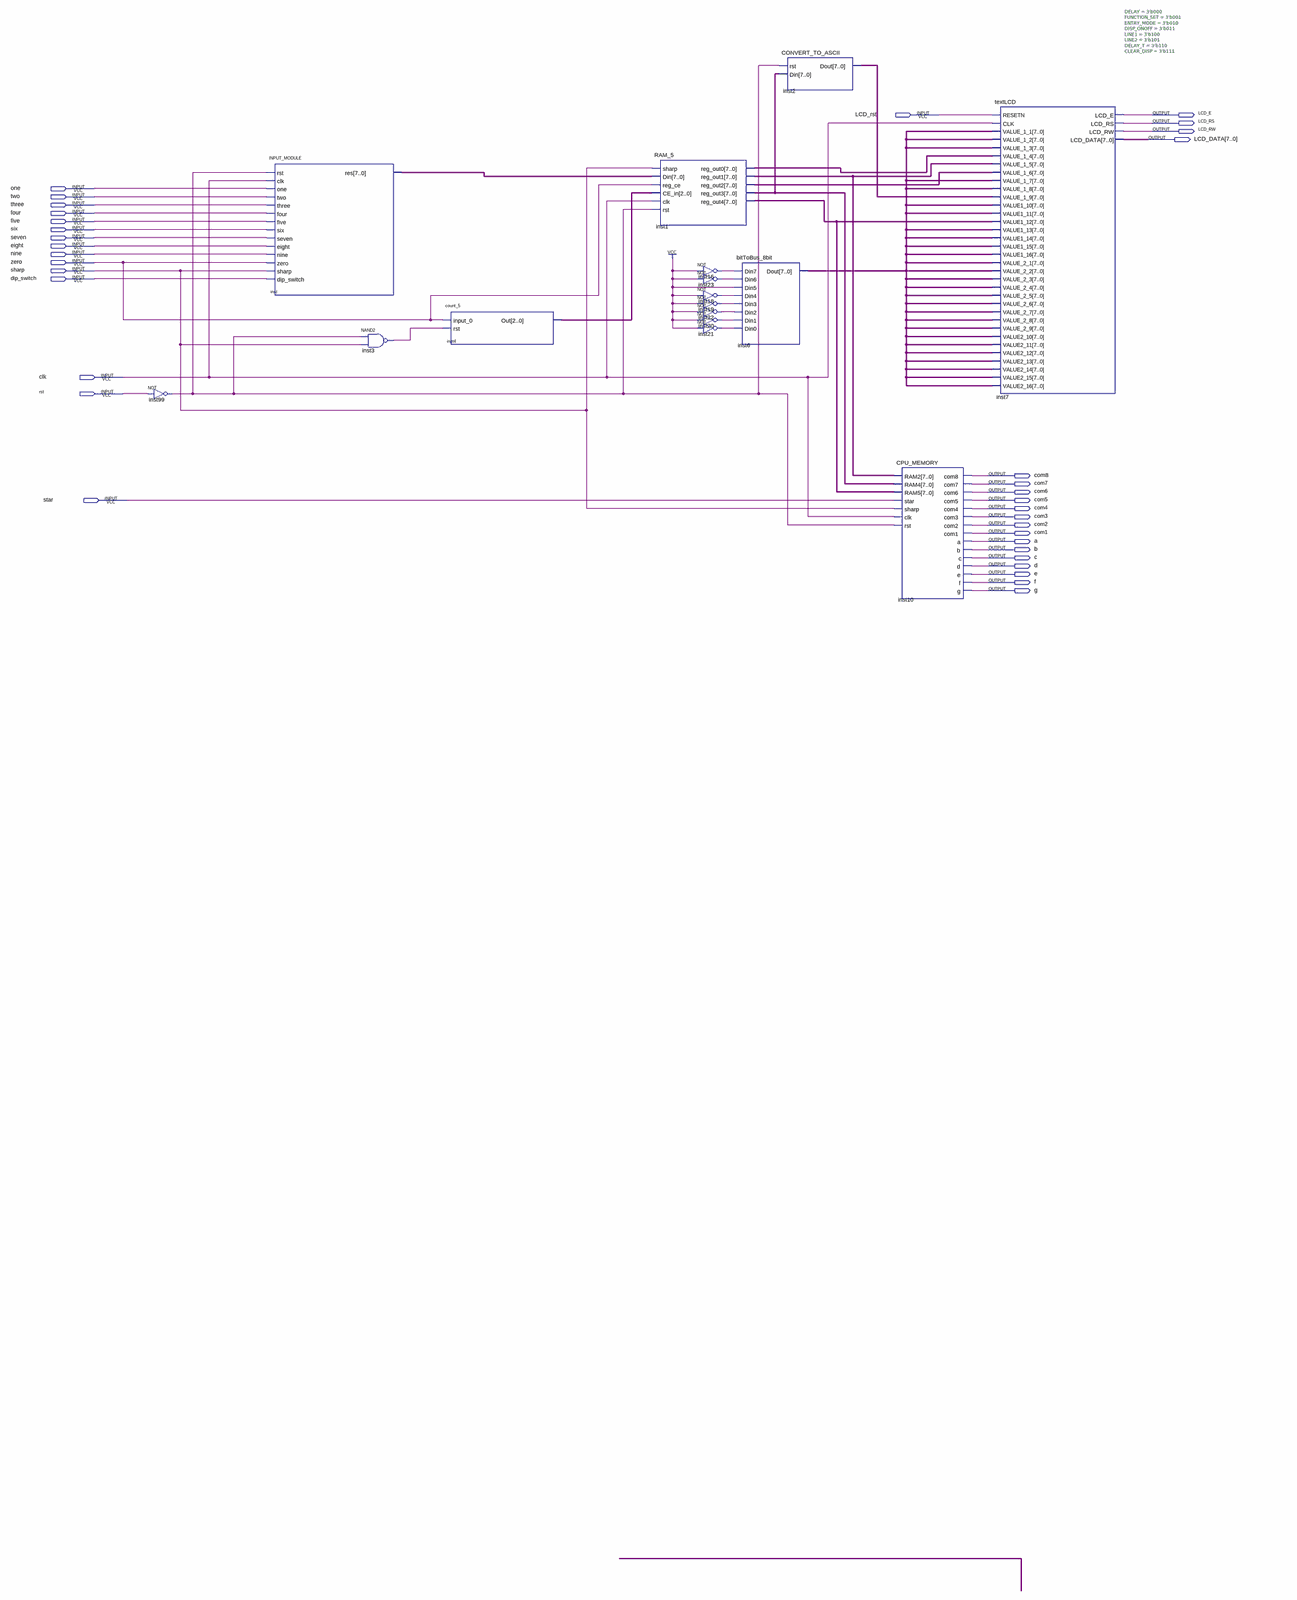
[diagram p0: schematic sheet, whole]
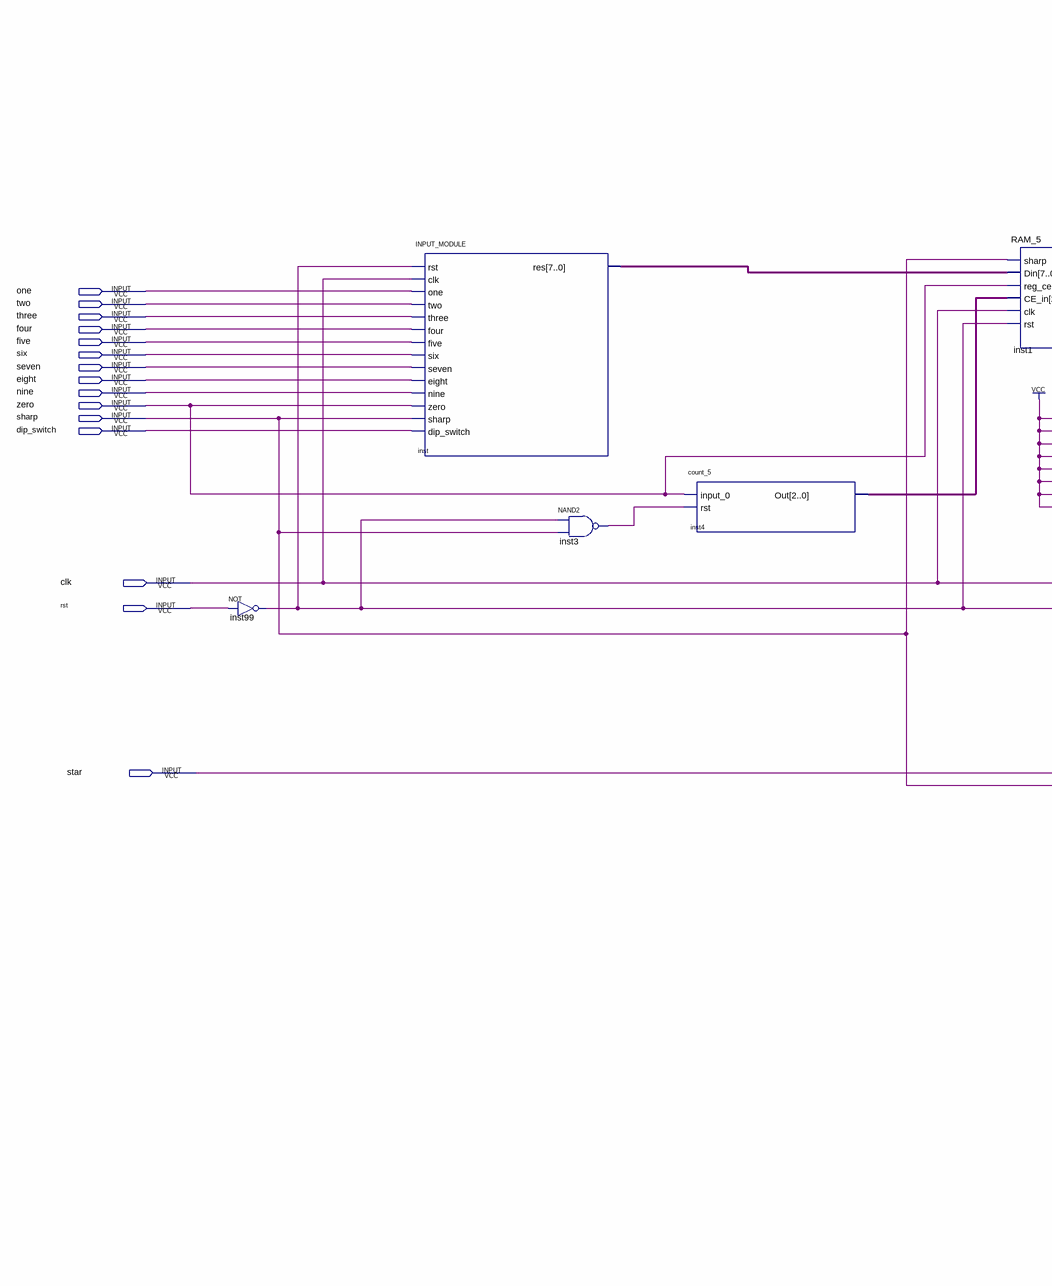
[diagram p1: schematic sheet, upper left part]
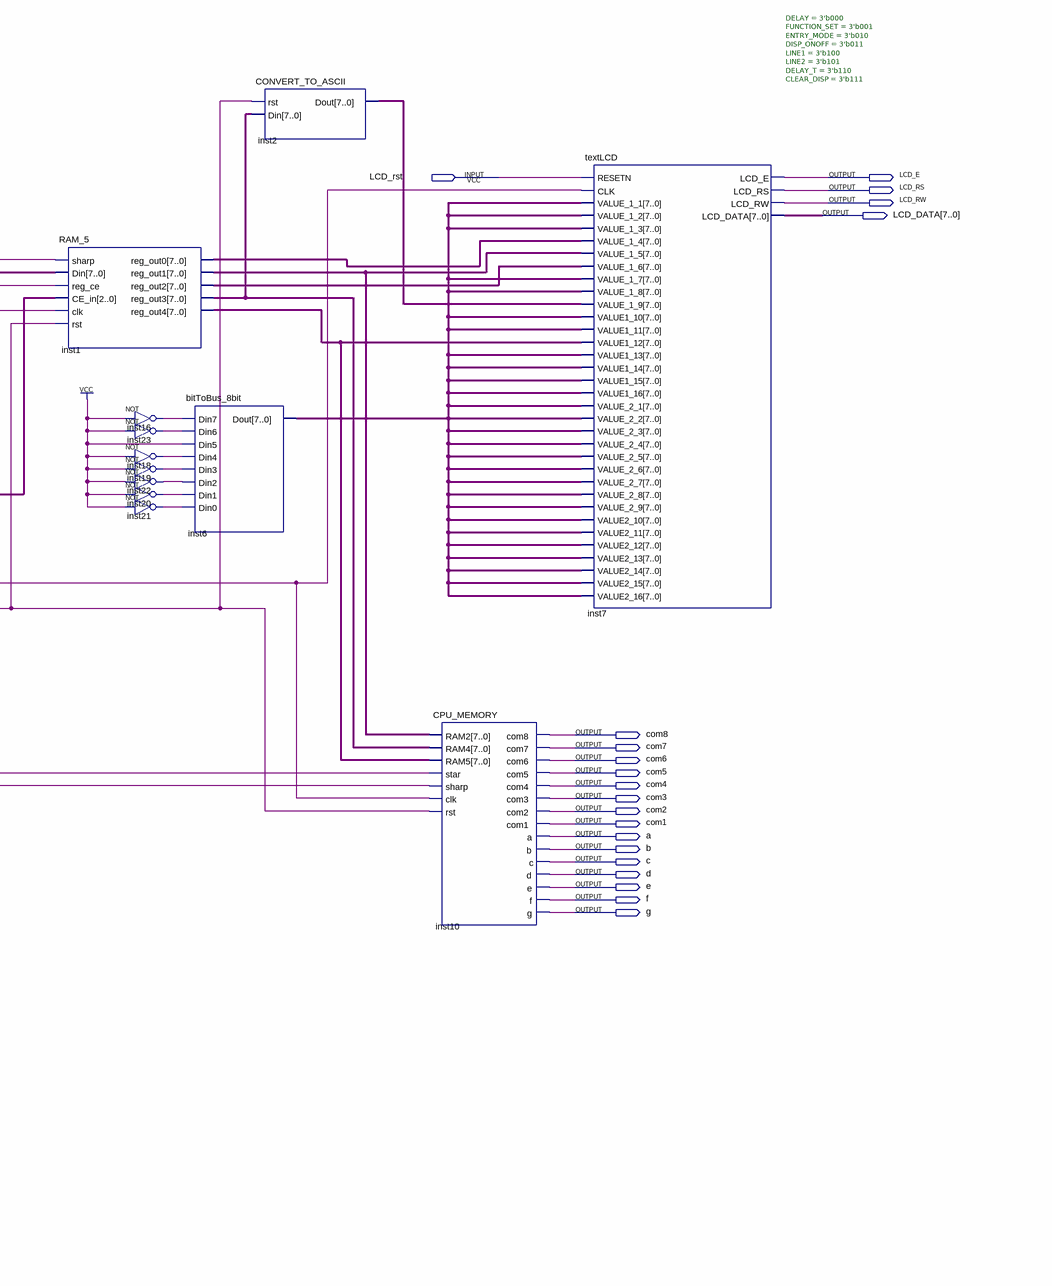
[diagram p2: schematic sheet, upper right part]
// Quartus schematic PROJECT.bdf as structural Verilog: 16 symbols, 35 pins
module PROJECT (
  input  LCD_rst,
  input  one,
  input  two,
  input  three,
  input  four,
  input  five,
  input  six,
  input  seven,
  input  eight,
  input  nine,
  input  zero,
  input  sharp,
  input  dip_switch,
  input  clk,
  input  rst,
  input  star,
  output LCD_E,
  output LCD_RS,
  output LCD_RW,
  output [7:0] LCD_DATA,
  output com8,
  output com7,
  output com6,
  output com5,
  output com4,
  output com3,
  output com2,
  output com1,
  output a,
  output b,
  output c,
  output d,
  output e,
  output f,
  output g
);

  wire inst3_out, inst16_out, inst18_out, inst19_out, inst20_out, inst21_out, inst22_out, inst23_out,
       inst99_out;
  wire [2:0] inst4_out;
  wire [7:0] inst1_reg_out0, inst1_reg_out1, inst1_reg_out2, inst1_reg_out3, inst1_reg_out4, inst2_dout,
       inst6_dout, inst_res;

  not inst99 (inst99_out, rst);
  INPUT_MODULE inst (
    .rst(inst99_out), .clk(clk), .one(one), .two(two), .three(three), .four(four), .five(five), .six(six),
    .seven(seven), .eight(eight), .nine(nine), .zero(zero), .sharp(sharp), .dip_switch(dip_switch),
    .res(inst_res));
  nand inst3 (inst3_out, inst99_out, sharp);
  count_5 inst4 (.input_0(zero), .rst(inst3_out), .Out(inst4_out));
  RAM_5 inst1 (
    .sharp(sharp), .Din(inst_res), .reg_ce(zero), .CE_in(inst4_out), .clk(clk), .rst(inst99_out),
    .reg_out0(inst1_reg_out0), .reg_out1(inst1_reg_out1), .reg_out2(inst1_reg_out2),
    .reg_out3(inst1_reg_out3), .reg_out4(inst1_reg_out4));
  not inst16 (inst16_out, 1'b1);
  not inst23 (inst23_out, 1'b1);
  not inst18 (inst18_out, 1'b1);
  not inst19 (inst19_out, 1'b1);
  not inst22 (inst22_out, 1'b1);
  not inst20 (inst20_out, 1'b1);
  not inst21 (inst21_out, 1'b1);
  bitToBus_8bit inst6 (
    .Din7(inst16_out), .Din6(inst23_out), .Din5(1'b1), .Din4(inst18_out), .Din3(inst19_out),
    .Din2(inst22_out), .Din1(inst20_out), .Din0(inst21_out), .Dout(inst6_dout));
  CONVERT_TO_ASCII inst2 (.rst(inst99_out), .Din(inst1_reg_out3), .Dout(inst2_dout));
  CPU_MEMORY inst10 (
    .RAM2(inst1_reg_out1), .RAM4(inst1_reg_out3), .RAM5(inst1_reg_out4), .star(star), .sharp(sharp),
    .clk(clk), .rst(inst99_out), .com8(com8), .com7(com7), .com6(com6), .com5(com5), .com4(com4),
    .com3(com3), .com2(com2), .com1(com1), .a(a), .b(b), .c(c), .d(d), .e(e), .f(f), .g(g));
  textLCD #(.DELAY(3'b000), .FUNCTION_SET(3'b001), .ENTRY_MODE(3'b010), .DISP_ONOFF(3'b011), .LINE1(3'b100), .LINE2(3'b101), .DELAY_T(3'b110), .CLEAR_DISP(3'b111)) inst7 (
    .RESETN(LCD_rst), .CLK(clk), .VALUE_1_1(inst6_dout), .VALUE_1_2(inst6_dout), .VALUE_1_3(inst6_dout),
    .VALUE_1_4(inst1_reg_out0), .VALUE_1_5(inst1_reg_out1), .VALUE_1_6(inst1_reg_out2),
    .VALUE_1_7(inst6_dout), .VALUE_1_8(inst6_dout), .VALUE_1_9(inst2_dout), .VALUE1_10(inst6_dout),
    .VALUE1_11(inst6_dout), .VALUE1_12(inst1_reg_out4), .VALUE1_13(inst6_dout), .VALUE1_14(inst6_dout),
    .VALUE1_15(inst6_dout), .VALUE1_16(inst6_dout), .VALUE_2_1(inst6_dout), .VALUE_2_2(inst6_dout),
    .VALUE_2_3(inst6_dout), .VALUE_2_4(inst6_dout), .VALUE_2_5(inst6_dout), .VALUE_2_6(inst6_dout),
    .VALUE_2_7(inst6_dout), .VALUE_2_8(inst6_dout), .VALUE_2_9(inst6_dout), .VALUE2_10(inst6_dout),
    .VALUE2_11(inst6_dout), .VALUE2_12(inst6_dout), .VALUE2_13(inst6_dout), .VALUE2_14(inst6_dout),
    .VALUE2_15(inst6_dout), .VALUE2_16(inst6_dout), .LCD_E(LCD_E), .LCD_RS(LCD_RS), .LCD_RW(LCD_RW),
    .LCD_DATA(LCD_DATA));
endmodule
